# Altium project SolarPanel_+X.PrjPCB
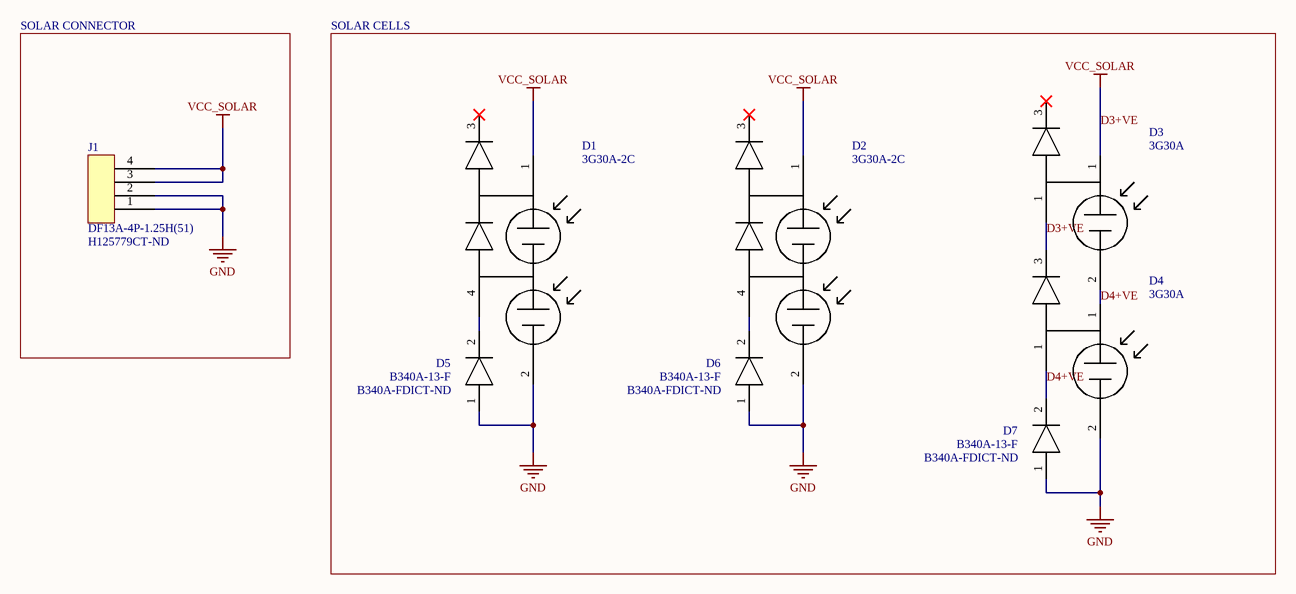
[diagram p0: SolarPanel_+X.SchDoc]
PROJ_AUTHOR: Zeng, Dylan V.; PROJ_VERSION: 2.1
1 sheet, 8 parts. Net scope: global (net labels, ports and power ports of the same name join across sheets).
Board file: SolarPanel_+X_v2.PcbDoc

## Sheet SolarPanel_+X.SchDoc
size A4

### Parts
D1  3G30A-2C  [3G30A_2C]
D2  3G30A-2C  [3G30A_2C]
D3  3G30A  [3G30A]
D4  3G30A  [3G30A]
D5  B340A-13-F  Supplier Part Number 1: B340A-FDICT-ND  [B340A-13-F]
D6  B340A-13-F  Supplier Part Number 1: B340A-FDICT-ND  [B340A-13-F]
D7  B340A-13-F  Supplier Part Number 1: B340A-FDICT-ND  [B340A-13-F]
J1  DF13A-4P-1.25H(51)  Supplier Part Number 1: H125779CT-ND  [DF13A-4P-1.25H(51)]

### Blocks framed on the sheet
SOLAR CONNECTOR: J1
SOLAR CELLS: D1-D7

### Nets
GND: D1.2 D2.2 D4.2 D5.1 D6.1 D7.1 J1.1 J1.2
VCC_SOLAR: D1.1 D2.1 D3.1 D4.3 J1.3 J1.4  [also labelled D3+VE]
D4+VE: D3.2 D4.1 D7.2
NetD1_4: D1.4 D5.2
NetD2_4: D2.4 D6.2

Not connected (* = marked no-connect by the designer): D1 3*; D2 3*; D3 3*

### Library data of the parts
D1 D2 = 3G30A-2C: Solar cell x2
D3 D4 = 3G30A: Single solar cell
D5-D7 = B340A-13-F: Schottky diode; Supplier 1: Digi-Key
J1 = DF13A-4P-1.25H(51): 4 pos DF13 right angle surface mount connector; Supplier 1: Digi-Key